# EAGLE design joystick-tact breakout (EAGLE 9.0.1)
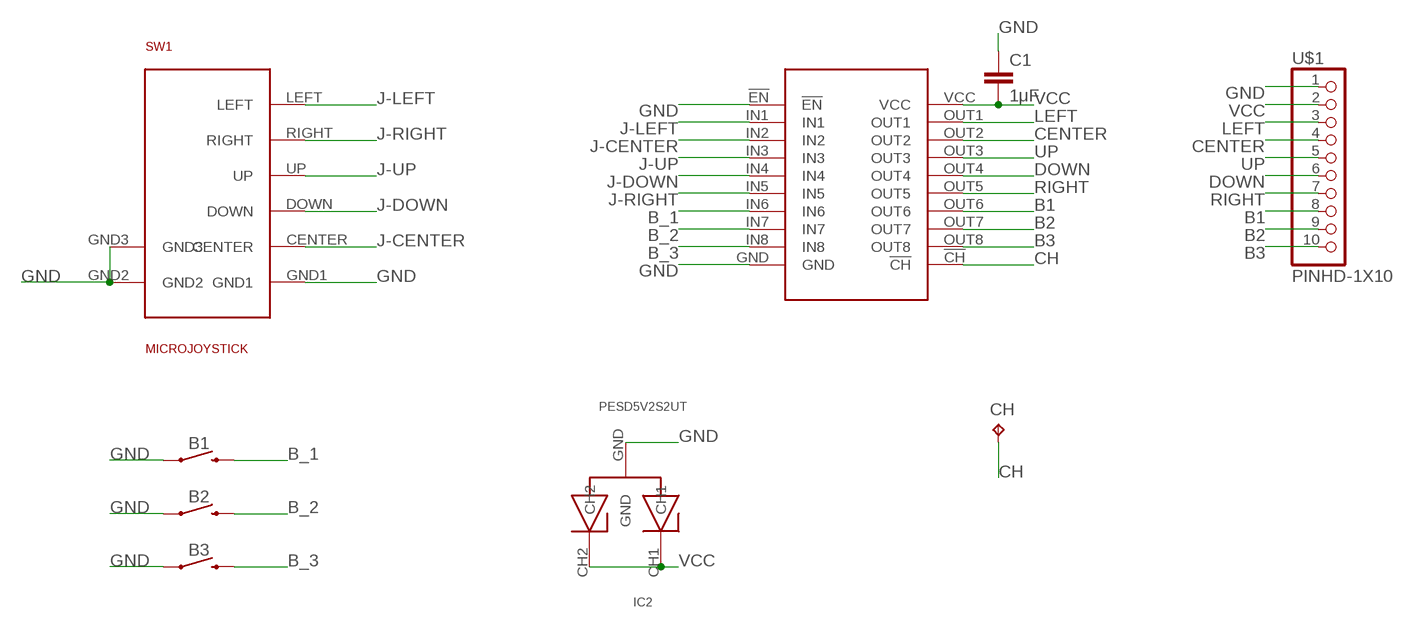
[diagram p0: schematic, sheet 1]

## Parts
B1  MOMENTARY-SWITCH-SPST-SMD-4.5MM  [TACTILE_SWITCH_SMD_4.5MM]
B2  MOMENTARY-SWITCH-SPST-SMD-4.5MM  [TACTILE_SWITCH_SMD_4.5MM]
B3  MOMENTARY-SWITCH-SPST-SMD-4.5MM  [TACTILE_SWITCH_SMD_4.5MM]
C1  1μF  C-EUC0805  [C0805]
CH  TPB2,54  [B2,54]
IC1  MAX6818  [TSSOP20]
IC2  PESD5V2S2UT  PESDXS2UT  [SOT-23]
SW1  MICROJOYSTICK  [MICROJOYSTICK]
U$1  PINHD-1X10  [1X10-BIG]

## Nets
B1: IC1.OUT6 U$1.8
B2: IC1.OUT7 U$1.9
B3: IC1.OUT8 U$1.10
B_1: B1.1 B1.4 IC1.IN6
B_2: B2.1 B2.4 IC1.IN7
B_3: B3.1 B3.4 IC1.IN8
CENTER: IC1.OUT2 U$1.4
CH: CH.TP IC1.!CH!
DOWN: IC1.OUT4 U$1.6
GND: B1.2 B1.3 B2.2 B2.3 B3.2 B3.3 C1.1 IC1.!EN! IC1.GND IC2.GND SW1.GND1 SW1.GND2 SW1.GND3 U$1.1
J-CENTER: IC1.IN2 SW1.CENTER
J-DOWN: IC1.IN4 SW1.DOWN
J-LEFT: IC1.IN1 SW1.LEFT
J-RIGHT: IC1.IN5 SW1.RIGHT
J-UP: IC1.IN3 SW1.UP
LEFT: IC1.OUT1 U$1.3
RIGHT: IC1.OUT5 U$1.7
UP: IC1.OUT3 U$1.5
VCC: C1.2 IC1.VCC IC2.CH1 IC2.CH2 U$1.2

## Library data of the parts
B1-B3 = SparkFun-Switches:MOMENTARY-SWITCH-SPST: Momentary Switch (Pushbutton) - SPST Normally-open (NO) SPST momentary switches (buttons, pushbuttons). Variants PTH-12MM - 12mm square, through-hole Momentary Pushbutton Switch - 12mm Square <https://www.sparkfun.com/products/9190> (COM-09190) PTH-6.0MM, PTH-6.0MM-KIT - 6.0mm square, through-hole Mini Pushbutton Switch <https://www.sparkfun.com/products/97> (COM-00097) KIT package intended for soldering kit's - only one side of pads' copper is exposed. PTH-RIGHT-ANGLE-KIT - Right-angle, through-hole Right Angle Tactile Button <https://www.sparkfun.com/products/10791> - Used on SparkFun BigTime Watch Kit <https://www.sparkfun.com/products/11734> SMD-12MM - 12mm square, surface-mount Tactile Button - SMD (12mm) <https://www.sparkfun.com/products/12993> (COM-12993) Used on SparkFun PicoBoard <https://www.sparkfun.com/products/11888> SMD-4.5MM - 4.5mm Square Trackball Switch Used on SparkFun Blackberry Trackballer Breakout <https://www.sparkfun.com/products/13169> SMD-4.6MMX2.8MM - 4.60mm x 2.80mm, surface mount Used on SparkFun SAMD21 Mini Breakout <https://www.sparkfun.com/products/13664> SMD-5.2MM, SMD-5.2-REDUNDANT - 5.2mm square, surface-mount Mini Pushbutton Switch - SMD <https://www.sparkfun.com/products/8720> (COM-08720) Used on Arduino Pro Mini <https://www.sparkfun.com/products/11114> REDUNDANT package connects both switch circuits together SMD-6.0X3.5MM - 6.0 x 3.5mm, surface mount Momentary Reset Switch SMD <https://www.sparkfun.com/products/8229> (COM-08229) SMD-6.2MM-TALL - 6.2mm square, surface mount Tactile Button - SMD (6mm) <https://www.sparkfun.com/products/12992> Used on SparkFun Digital Sandbox <https://www.sparkfun.com/products/12651> SMD-RIGHT-ANGLE - Right-angle, surface mount Used on SparkFun Block for Intel® Edison - Arduino <https://www.sparkfun.com/products/13036>; PROD_ID: SWCH-09213
C1 = rcl:C-EU: CAPACITOR, European symbol; SPICEPREFIX: C
CH = testpad:TP: Test pad
IC1 = MAX6818 CMOS Switch debouncer:MAX6818
IC2 = PESDxS2UT:PESDXS2UT
SW1 = micro joystick:MICROJOYSTICK
U$1 = adafruit:PINHD-1X10: Pin header 1x10 0.1" spacing With round pins

## Board
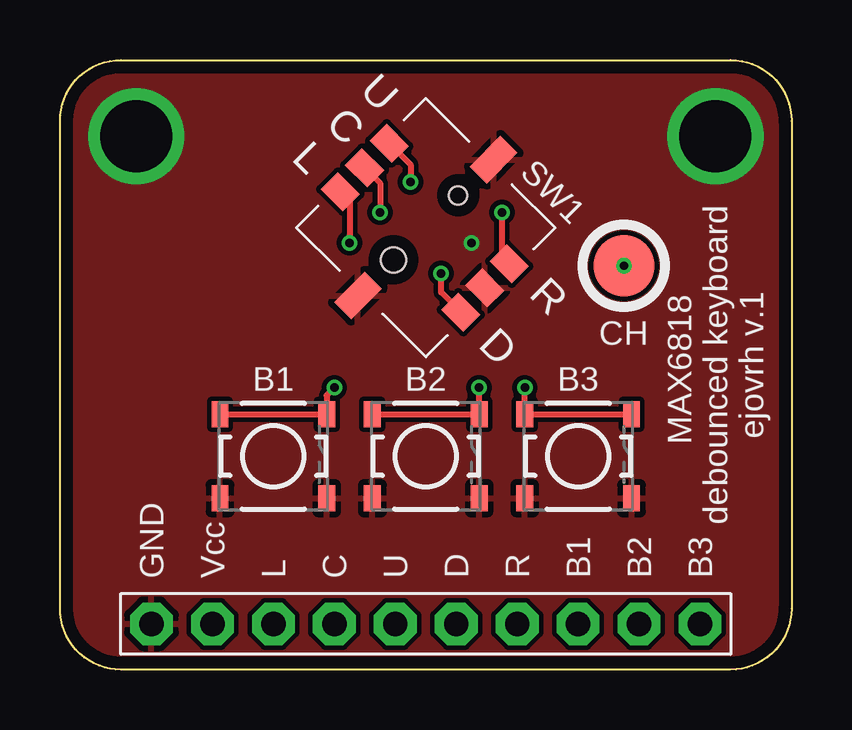
[diagram p1: board, top side]
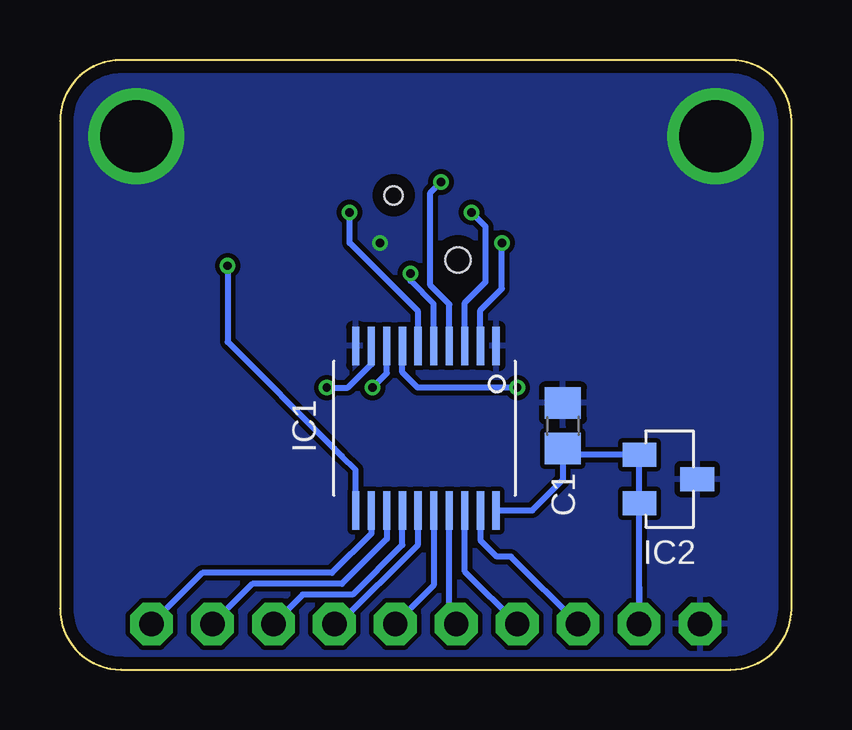
[diagram p2: board, bottom side, seen from below]

Size 30.48 x 25.4 mm. Coordinates in mm from the lower left corner, seen from the top.
Outline: 2.54,25.4 27.94,25.4 arc-90 30.48,22.86 30.48,2.54 arc-90 27.94,0 2.54,0 arc-90 0,2.54 0,22.86 arc-90 2.54,25.4
Copper layers (1*16): Top 0.035mm / dielectric 1.5mm / Bottom 0.035mm
Design rules "markovac_2layer": minimum track width 0.2mm, minimum drill 0.35mm, track to track 0.2mm, track to pad 0.2mm, pad to pad 0.2mm, via to via 0.2mm, smd to smd 0.2mm, copper to edge 0.5mm, drill to drill 8mil, minimum pad ring 0.15mm, minimum via ring 0.15mm, stop-mask expansion 4mil, vias tented up to drill 0.35mm, thermal gap 10mil

### Footprints (pad centres in the part's own frame; a part is rotated, then mirrored left to right if it is on the bottom)
TACTILE_SWITCH_SMD_4.5MM = smd 0.7 x 1.1: 1 2.225,1.75; 2 2.225,-1.75; 3 -2.225,-1.75; 4 -2.225,1.75
C0805 = smd 1.3 x 1.5: 1 -0.95,0; 2 0.95,0
B2,54 = smd 2.54 x 2.54: TP 0,0
TSSOP20 = smd 0.3 x 1.6: !CH! 2.92,3.525; !EN! -2.93,-3.325; GND 2.92,-3.325; IN1 -2.28,-3.325; IN2 -1.63,-3.325; IN3 -0.98,-3.325; IN4 -0.33,-3.325; IN5 0.32,-3.325; IN6 0.97,-3.325; IN7 1.62,-3.325; IN8 2.27,-3.325; OUT1 -2.28,3.525; OUT2 -1.63,3.525; OUT3 -0.98,3.525; OUT4 -0.33,3.525; OUT5 0.32,3.525; OUT6 0.97,3.525; OUT7 1.62,3.525; OUT8 2.27,3.525; VCC -2.93,3.525
SOT-23 = smd 1 x 1.4: CH1 -1.016,-1.262; CH2 1.016,-1.262; GND 0,1.151
MICROJOYSTICK = smd 1.3 x 1: CENTER -3.575,-0.035; DOWN 3.52,-1.46; GND1 3.52,-0.035; LEFT -3.57,-1.46; RIGHT 3.52,1.39; UP -3.555,1.405 | smd 1 x 1.8: GND2 0,4; GND3 0,-4 | hole 0.75: 0,1.9 | hole 1.05: 0,-1.9
1X10-BIG = drill 1.016 pad 1.778 octagon: 1 -11.43,0; 2 -8.89,0; 3 -6.35,0; 4 -3.81,0; 5 -1.27,0; 6 1.27,0; 7 3.81,0; 8 6.35,0; 9 8.89,0; 10 11.43,0

### Placement (x,y rotation side)
B1  8.89,8.89 0 top
B2  15.24,8.89 0 top
B3  21.59,8.89 0 top
C1  9.53,10.16 270 bottom
CH  23.5,16.83 0 top
IC1  15.24,10.16 180 bottom
IC2  5.08,7.94 270 bottom
SW1  15.24,18.41 315 top
U$1  15.24,1.91 0 top

### Tracks (layer width: path | path; a pad name or v marks a point on that pad's centre or on a via)
B1
  Bottom 0.254: IC1.OUT6 16.21,5.2 18.29,3.12 20.37,3.12 U$1.8
B2
  Bottom 0.254: IC1.OUT7 16.86,5.45 18.73,3.58 22.46,3.58 U$1.9
B3
  Bottom 0.254: IC1.OUT8 17.51,5.67 19.15,4.03 24.55,4.03 U$1.10
B_1  (via drill 0.35)
  Top 0.254: B1.4 B1.1 11.12,11.43 11.11,11.43 v11.43,11.75
  Bottom 0.254: IC1.IN6 16.21,12.38 15.57,11.75 v11.43,11.75
B_2  (via drill 0.35)
  Top 0.254: B2.4 B2.1 v17.46,11.74 v17.46,11.75
  Bottom 0.254: v17.46,11.75 16.86,12.35 IC1.IN7
B_3  (via drill 0.35)
  Top 0.254: B3.1 B3.4 v19.36,11.74 v19.37,11.75
  Bottom 0.254: IC1.IN8 17.51,12.72 18.48,11.75 v19.37,11.75
CENTER
  Bottom 0.254: U$1.4 13.61,4.08 IC1.OUT2
CH  (via drill 0.35)
  Bottom 0.254: CH.TP 23.5,13.65 19.05,9.21 18.73,8.89 18.16,8.32 IC1.!CH!
  other vias: 23.5,16.83
DOWN
  Bottom 0.254: U$1.6 14.91,3.5 IC1.OUT4
GND  (via drill 0.35, 3)
  other vias: 17.14,17.78 3.17,22.23 27.3,22.23
  pour Top: 0,25.4 30.48,25.4 30.48,0 0,0
  pour Bottom: 0,25.4 30.48,25.4 30.48,0 0,0
J-CENTER  (via drill 0.35)
  Top 0.254: SW1.CENTER 13.34,20.27 v13.34,19.05
  Bottom 0.254: v13.34,19.05 12.74,18.46 12.74,16.16 13.61,15.29 IC1.IN2
J-DOWN  (via drill 0.35)
  Top 0.254: SW1.DOWN 15.88,15.71 v15.88,16.51
  Bottom 0.254: IC1.IN4 14.91,15.23 15.88,16.19 v15.88,16.51
J-LEFT  (via drill 0.35)
  Top 0.254: SW1.LEFT 12.06,19.52 v12.06,17.78
  Bottom 0.254: IC1.IN1 12.96,14.98 12.06,15.88 v12.06,17.78
J-RIGHT  (via drill 0.35)
  Top 0.254: v18.41,19.05 18.41,17.21 SW1.RIGHT
  Bottom 0.254: v18.41,19.05 18.41,17.78 15.56,14.93 IC1.IN5
J-UP  (via drill 0.35)
  Top 0.254: SW1.UP 14.61,21.04 v14.61,20.32
  Bottom 0.254: v14.61,20.32 15.05,19.88 15.05,16.01 14.26,15.22 IC1.IN3
LEFT
  Bottom 0.254: IC1.OUT1 12.96,5.4 12.28,4.71 11.7,4.71 U$1.3
RIGHT
  Bottom 0.254: 15.56,6.35 IC1.OUT5 15.56,5.21 18.86,1.91 U$1.7
UP
  Bottom 0.254: U$1.5 14.26,2.19 IC1.OUT3
VCC
  Bottom 0.254: IC1.VCC 10.79,6.63 9.53,7.91 C1.2 9.27,8.95 IC2.CH1 IC2.CH2 U$1.2 6.35,3.46

### Text on the board
tNames: MAX6818 / debounced keyboard / ejovrh v.1 | GND | Vcc | L | C | U | D | R | B1 | B2 | B3